# Altium schematic sheet 03_EINK.SchDoc
size A4; Author: Sasa Karanovic; Organization: Altium Limited; DocumentNumber: 1; SheetNumber: 3; SheetTotal: 4; sk_ProjectName: DIY E-Ink Gadget; sk_title: E-Ink Driving Circuit
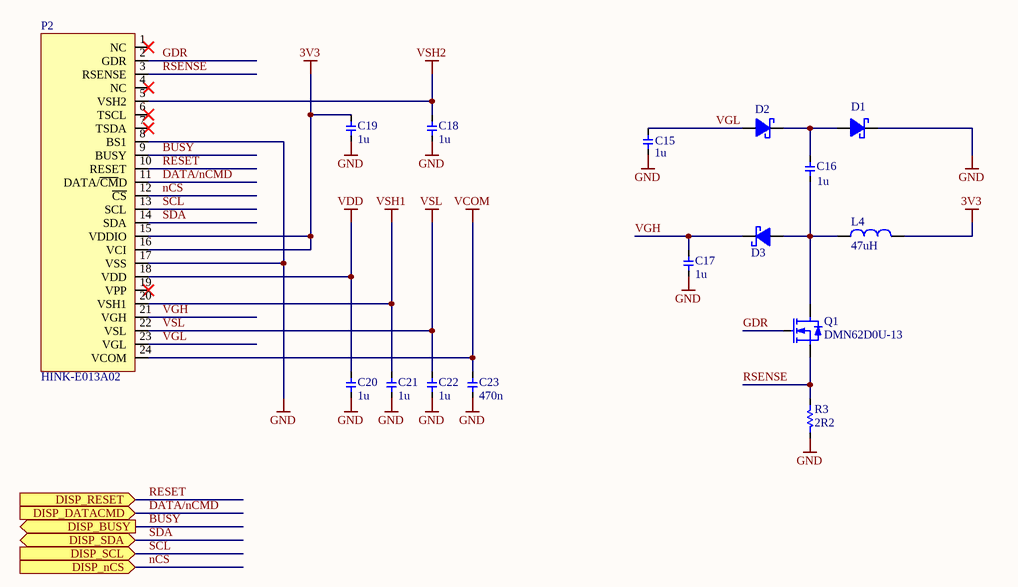
[diagram p0: 03_EINK.SchDoc]

## Parts
C15  value 1u  [0603 - CAP HS]  (hidden comment: Cap)
C16  value 1u  [0603 - CAP HS]  (hidden comment: Cap)
C17  value 1u  [0603 - CAP HS]  (hidden comment: Cap)
C18  value 1u  [0603 - CAP HS]  (hidden comment: Cap)
C19  value 1u  [0603 - CAP HS]  (hidden comment: Cap)
C20  value 1u  [0603 - CAP HS]  (hidden comment: Cap)
C21  value 1u  [0603 - CAP HS]  (hidden comment: Cap)
C22  value 1u  [0603 - CAP HS]  (hidden comment: Cap)
C23  value 470n  [0603 - CAP HS]  (hidden comment: Cap)
D1  Diode Schotky  [SOD123F]  (value not drawn)
D2  Diode Schotky  [SOD123F]  (value not drawn)
D3  Diode Schotky  [SOD123F]  (value not drawn)
L4  value 47uH  [IND_5050]  (hidden comment: Inductor)
P2  HINK-E013A02  [SFV24R-1STE1HLF]
Q1  DMN62D0U-13  [SOT90P240X100-3N]
R3  value 2R2  [0603 - HS]  (hidden comment: Res)

## Ports
DISP_BUSY (out), DISP_DATACMD (in), DISP_nCS (in), DISP_RESET (in), DISP_SCL (in), DISP_SDA (bidir)

## Nets
3V3: C19.2 L4.1 P2.15(VDDIO) P2.16(VCI)
GND: C15.2 C17.2 C18.1 C19.1 C20.1 C21.1 C22.1 C23.1 D1.K P2.8(BS1) P2.17(VSS) R3.2
VCOM: C23.2 P2.24(VCOM)
VDD: C20.2 P2.18(VDD)
VSH1: C21.2 P2.20(VSH1)
VSH2: C18.2 P2.5(VSH2)
VSL: C22.2 P2.22(VSL)
BUSY: P2.9(BUSY) ; port DISP_BUSY
DATA/nCMD: P2.11(DATA/~{CM}D) ; port DISP_DATACMD
GDR: P2.2(GDR) Q1.1(G)
nCS: P2.12(~{CS}) ; port DISP_nCS
RESET: P2.10(RESET) ; port DISP_RESET
RSENSE: P2.3(RSENSE) Q1.2(S) R3.1
SCL: P2.13(SCL) ; port DISP_SCL
SDA: P2.14(SDA) ; port DISP_SDA
VGH: C17.1 D3.K P2.21(VGH)
VGL: C15.1 D2.A P2.23(VGL)
NetC16_1: C16.1 D3.A L4.2 Q1.3(D)
NetC16_2: C16.2 D1.A D2.K

Not connected (* = marked no-connect by the designer): P2 1(NC)* 4(NC)* 6(TSCL)* 7(TSDA)* 19(VPP)*

## Notes on the sheet
- Page
- Title
- www.SasaKaranovic.com <http://www.SasaKaranovic.com>
- of

## Library data of the parts
C15-C22 = Cap: Capacitor; Manufacturer: Samsung Electro-Mechanics; Manufacturer Part Number: CL10B105KA8VPNC; Distributor Part Number: 1276-6617-1-ND; Distributor: DigiKey
C23 = Cap: Capacitor; Manufacturer: Samsung Electro-Mechanics; Manufacturer Part Number: CL10B474KA8NNNC; Distributor Part Number: 1276-2083-1-ND; Distributor: DigiKey
D1-D3 = Diode Schotky: Manufacturer: onsemi; Manufacturer Part Number: NRVB130LSFT1G; Distributor: DigiKey; Distributor Part Number: NRVB130LSFT1GOSCT-ND
L4 = Inductor: Manufacturer: TDK Corporation; Manufacturer Part Number: VLCF5024T-470MR40-2; Distributor: DigiKey; Distributor Part Number: 445-8747-1-ND
P2 = SFV24R-1STE1HLF: Manufacturer: Amphenol ICC (FCI); Manufacturer Part Number: SFV24R-4STE1HLF; Distributor: DigiKey; Distributor Part Number: 609-SFV24R-4STE1HLFCT-ND
Q1 = DMN62D0U-13: MOSFET N-CH 60V 0.38A; Manufacturer: Diodes Incorporated; Manufacturer Part Number: DMN62D0U-13; Distributor: DigiKey; Distributor Part Number: DMN62D0U-13DICT-ND
R3 = Res: Resistor; Manufacturer: YAGEO; Manufacturer Part Number: RC0603FR-072R2L; Distributor: DigiKey; Distributor Part Number: 311-2.2HRCT-ND